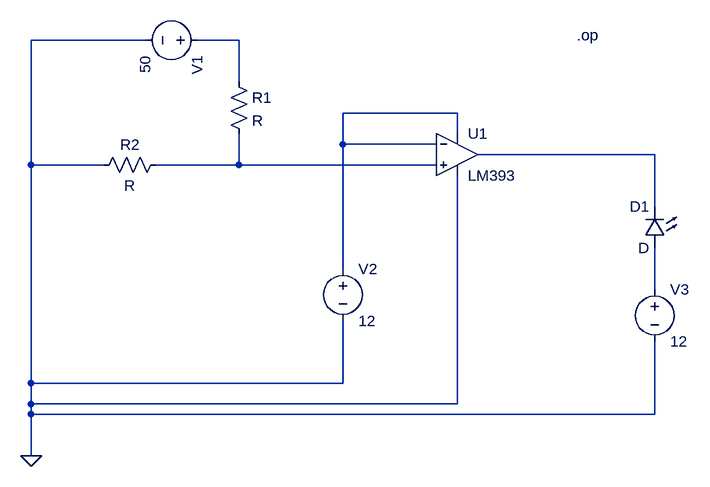
[diagram p0: schematic LM393Test.asc]
LM393Test.asc, the LTspice schematic file:
Version 4
SHEET 1 880 680
WIRE -576 0 -752 0
WIRE -432 0 -496 0
WIRE -432 64 -432 0
WIRE -96 112 -272 112
WIRE -96 144 -96 112
WIRE -272 160 -272 112
WIRE -128 160 -272 160
WIRE 208 176 -64 176
WIRE -752 192 -752 0
WIRE -640 192 -752 192
WIRE -432 192 -432 144
WIRE -432 192 -560 192
WIRE -128 192 -432 192
WIRE 208 256 208 176
WIRE -272 352 -272 160
WIRE 208 384 208 320
WIRE -752 528 -752 192
WIRE -272 528 -272 432
WIRE -272 528 -752 528
WIRE -752 560 -752 528
WIRE -96 560 -96 208
WIRE -96 560 -752 560
WIRE -752 576 -752 560
WIRE 208 576 208 464
WIRE 208 576 -752 576
WIRE -752 640 -752 576
FLAG -752 640 0
SYMBOL Opamps\\opamp2 -96 112 R0
SYMATTR InstName U1
SYMATTR Value LM393
SYMBOL voltage -480 0 R90
WINDOW 123 0 0 Left 0
WINDOW 39 0 0 Left 0
SYMATTR InstName V1
SYMATTR Value 50
SYMBOL voltage -272 336 R0
WINDOW 123 0 0 Left 0
WINDOW 39 0 0 Left 0
SYMATTR InstName V2
SYMATTR Value 12
SYMBOL res -448 48 R0
SYMATTR InstName R1
SYMBOL res -544 176 R90
WINDOW 0 0 56 VBottom 2
WINDOW 3 32 56 VTop 2
SYMATTR InstName R2
SYMBOL LED 224 320 R180
WINDOW 0 24 64 Left 2
WINDOW 3 24 0 Left 2
SYMATTR InstName D1
SYMBOL voltage 208 368 R0
WINDOW 123 0 0 Left 0
WINDOW 39 0 0 Left 0
SYMATTR InstName V3
SYMATTR Value 12
TEXT 88 -8 Left 2 !.op

The netlist it stands for:
* LM393Test.asc
XU1 N004 N002 N002 0 N003 LM393  ; pins In+ In- V+ V- OUT
V1 N001 0 50
V2 N002 0 12
R1 N001 N004 R
R2 N004 0 R
D1 N005 N003 D
V3 N005 0 12
.model D D
.lib standard.dio
.op
.backanno
.end